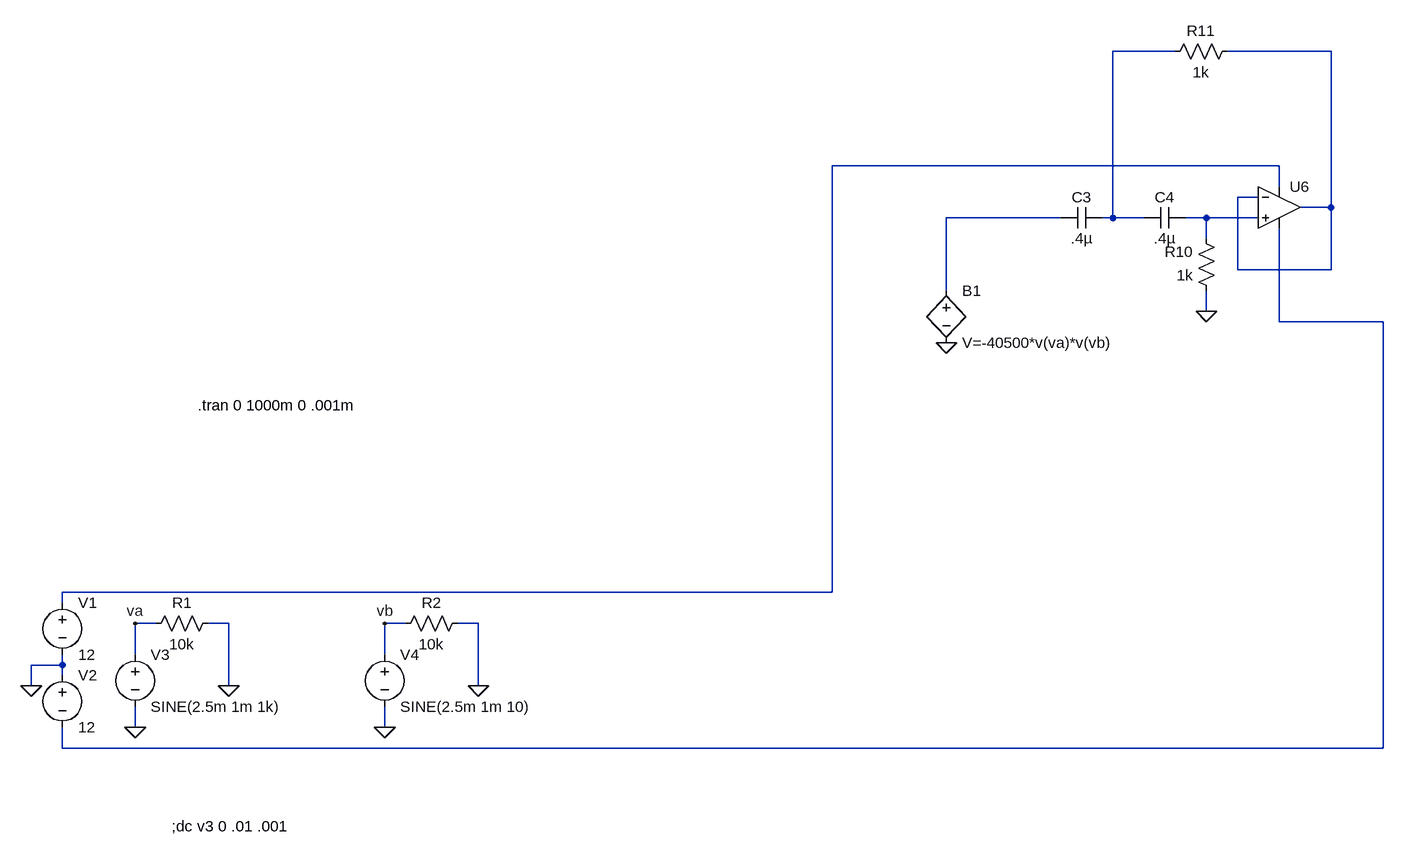
[diagram p0: schematic Multiplicador teorico.asc]
Multiplicador teorico.asc, the LTspice schematic file:
Version 4
SHEET 1 1432 680
WIRE 688 -1104 592 -1104
WIRE 928 -1104 768 -1104
WIRE 848 -928 160 -928
WIRE 848 -896 848 -928
WIRE 816 -880 784 -880
WIRE 928 -864 928 -1104
WIRE 928 -864 880 -864
WIRE 512 -848 336 -848
WIRE 592 -848 592 -1104
WIRE 592 -848 576 -848
WIRE 640 -848 592 -848
WIRE 736 -848 704 -848
WIRE 816 -848 736 -848
WIRE 736 -816 736 -848
WIRE 784 -768 784 -880
WIRE 928 -768 928 -864
WIRE 928 -768 784 -768
WIRE 336 -736 336 -848
WIRE 736 -704 736 -736
WIRE 848 -688 848 -832
WIRE 1008 -688 848 -688
WIRE 160 -272 160 -928
WIRE 160 -272 -1024 -272
WIRE -1024 -256 -1024 -272
WIRE -880 -224 -912 -224
WIRE -768 -224 -800 -224
WIRE -496 -224 -528 -224
WIRE -384 -224 -416 -224
WIRE -912 -176 -912 -224
WIRE -528 -176 -528 -224
WIRE -1024 -160 -1024 -176
WIRE -1024 -160 -1072 -160
WIRE -1024 -144 -1024 -160
WIRE -1072 -128 -1072 -160
WIRE -768 -128 -768 -224
WIRE -384 -128 -384 -224
WIRE -912 -64 -912 -96
WIRE -528 -64 -528 -96
WIRE -1024 -32 -1024 -64
WIRE 1008 -32 1008 -688
WIRE 1008 -32 -1024 -32
FLAG -1072 -128 0
FLAG -912 -64 0
FLAG -768 -128 0
FLAG -528 -64 0
FLAG -384 -128 0
FLAG -912 -224 va
FLAG -528 -224 vb
FLAG 336 -656 0
FLAG 736 -704 0
SYMBOL voltage -1024 -272 R0
WINDOW 123 0 0 Left 2
WINDOW 39 0 0 Left 2
SYMATTR InstName V1
SYMATTR Value 12
SYMBOL voltage -1024 -160 R0
WINDOW 123 0 0 Left 2
WINDOW 39 0 0 Left 2
SYMATTR InstName V2
SYMATTR Value 12
SYMBOL res -784 -240 R90
WINDOW 0 0 56 VBottom 2
WINDOW 3 32 56 VTop 2
SYMATTR InstName R1
SYMATTR Value 10k
SYMBOL voltage -912 -192 R0
WINDOW 123 0 0 Left 2
WINDOW 39 0 0 Left 2
SYMATTR InstName V3
SYMATTR Value SINE(2.5m 1m 1k)
SYMBOL res -400 -240 R90
WINDOW 0 0 56 VBottom 2
WINDOW 3 32 56 VTop 2
SYMATTR InstName R2
SYMATTR Value 10k
SYMBOL voltage -528 -192 R0
WINDOW 123 0 0 Left 2
WINDOW 39 0 0 Left 2
SYMATTR InstName V4
SYMATTR Value SINE(2.5m 1m 10)
SYMBOL bv 336 -752 R0
SYMATTR InstName B1
SYMATTR Value V=-40500*v(va)*v(vb)
SYMBOL res 752 -720 R180
WINDOW 0 36 76 Left 2
WINDOW 3 36 40 Left 2
SYMATTR InstName R10
SYMATTR Value 1k
SYMBOL cap 576 -864 R90
WINDOW 0 0 32 VBottom 2
WINDOW 3 32 32 VTop 2
SYMATTR InstName C3
SYMATTR Value .4µ
SYMBOL cap 704 -864 R90
WINDOW 0 0 32 VBottom 2
WINDOW 3 32 32 VTop 2
SYMATTR InstName C4
SYMATTR Value .4µ
SYMBOL res 672 -1088 R270
WINDOW 0 32 56 VTop 2
WINDOW 3 0 56 VBottom 2
SYMATTR InstName R11
SYMATTR Value 1k
SYMBOL Opamps\\UniversalOpamp2 848 -864 R0
SYMATTR InstName U6
TEXT -856 88 Left 2 !;dc v3 0 .01 .001
TEXT -816 -560 Left 2 !.tran 0 1000m 0 .001m

The netlist it stands for:
* Multiplicador teorico.asc
V1 N003 0 12
V2 0 N006 12
R1 0 va 10k
V3 va 0 SINE(2.5m 1m 1k)
R2 0 vb 10k
V4 vb 0 SINE(2.5m 1m 10)
B1 N004 0 V=-40500*v(va)*v(vb)
R10 0 N005 1k
C3 N001 N004 .4µ
C4 N005 N001 .4µ
R11 N001 N002 1k
XU6 N005 N002 N003 N006 N002 level.2 Avol=1Meg GBW=10Meg Slew=10Meg ilimit=25m rail=0 Vos=0 phimargin=45 en=0 enk=0 in=0 ink=0 Rin=500Meg  ; pins IN+ IN- V+ V- OUT
;dc v3 0 .01 .001
.tran 0 1000m 0 .001m
.lib UniversalOpamps2.sub
.backanno
.end